# Altium schematic sheet 03-Main.SchDoc
size D
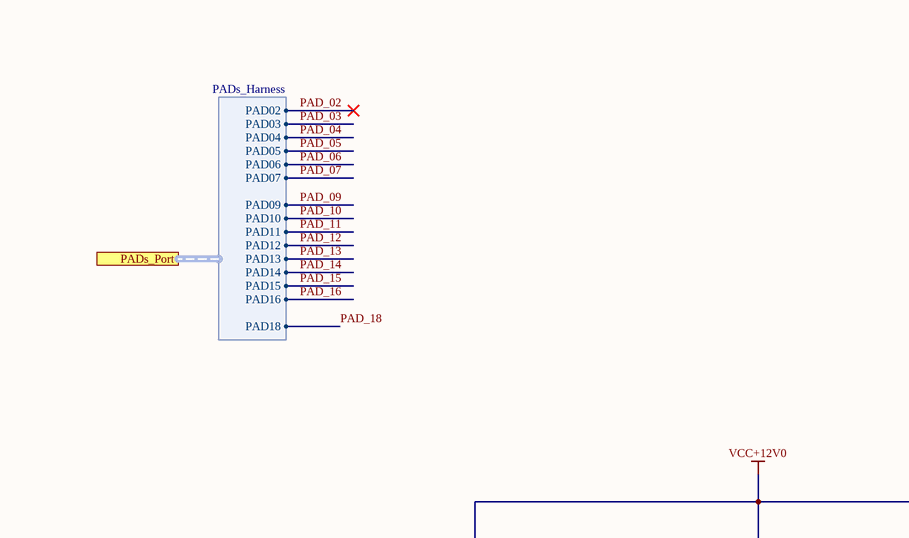
[diagram p0: 03-Main.SchDoc, top left]
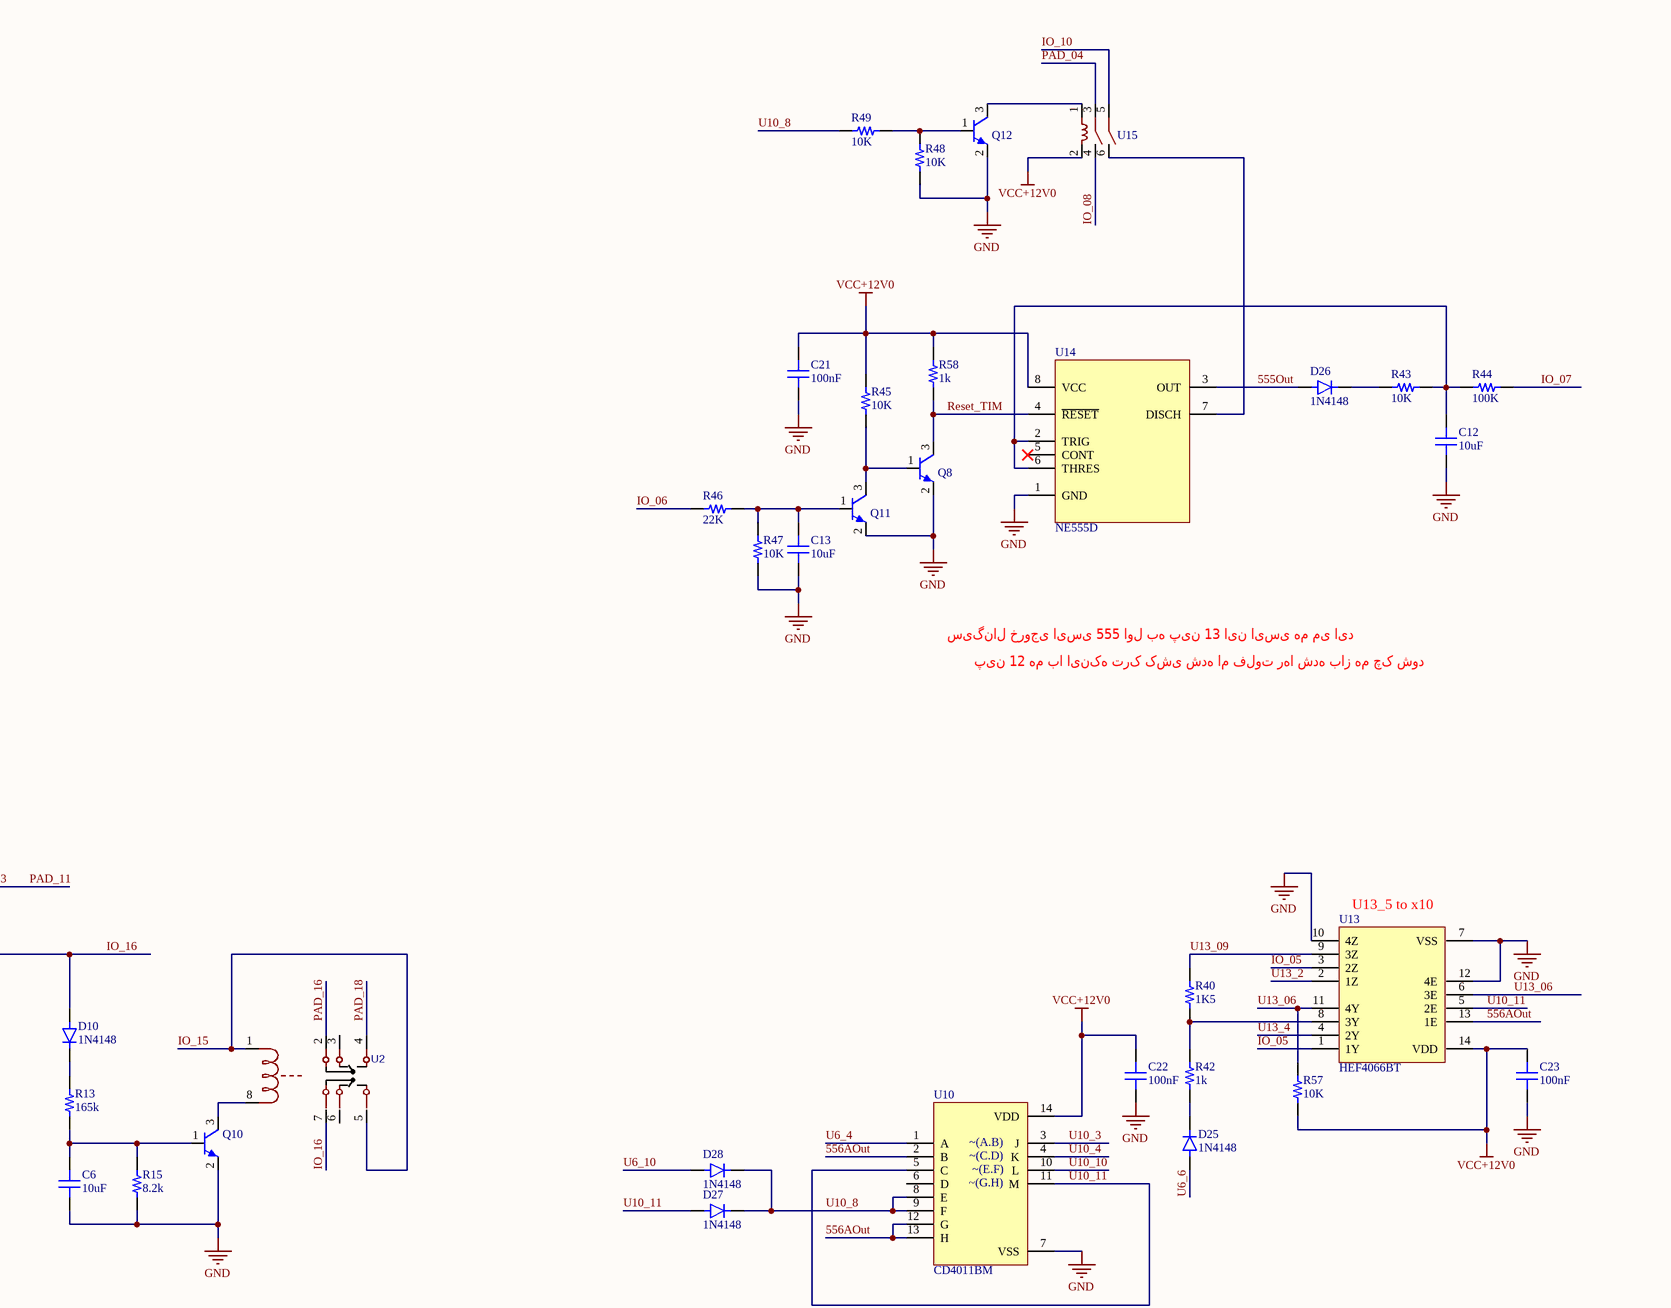
[diagram p1: 03-Main.SchDoc, top right]
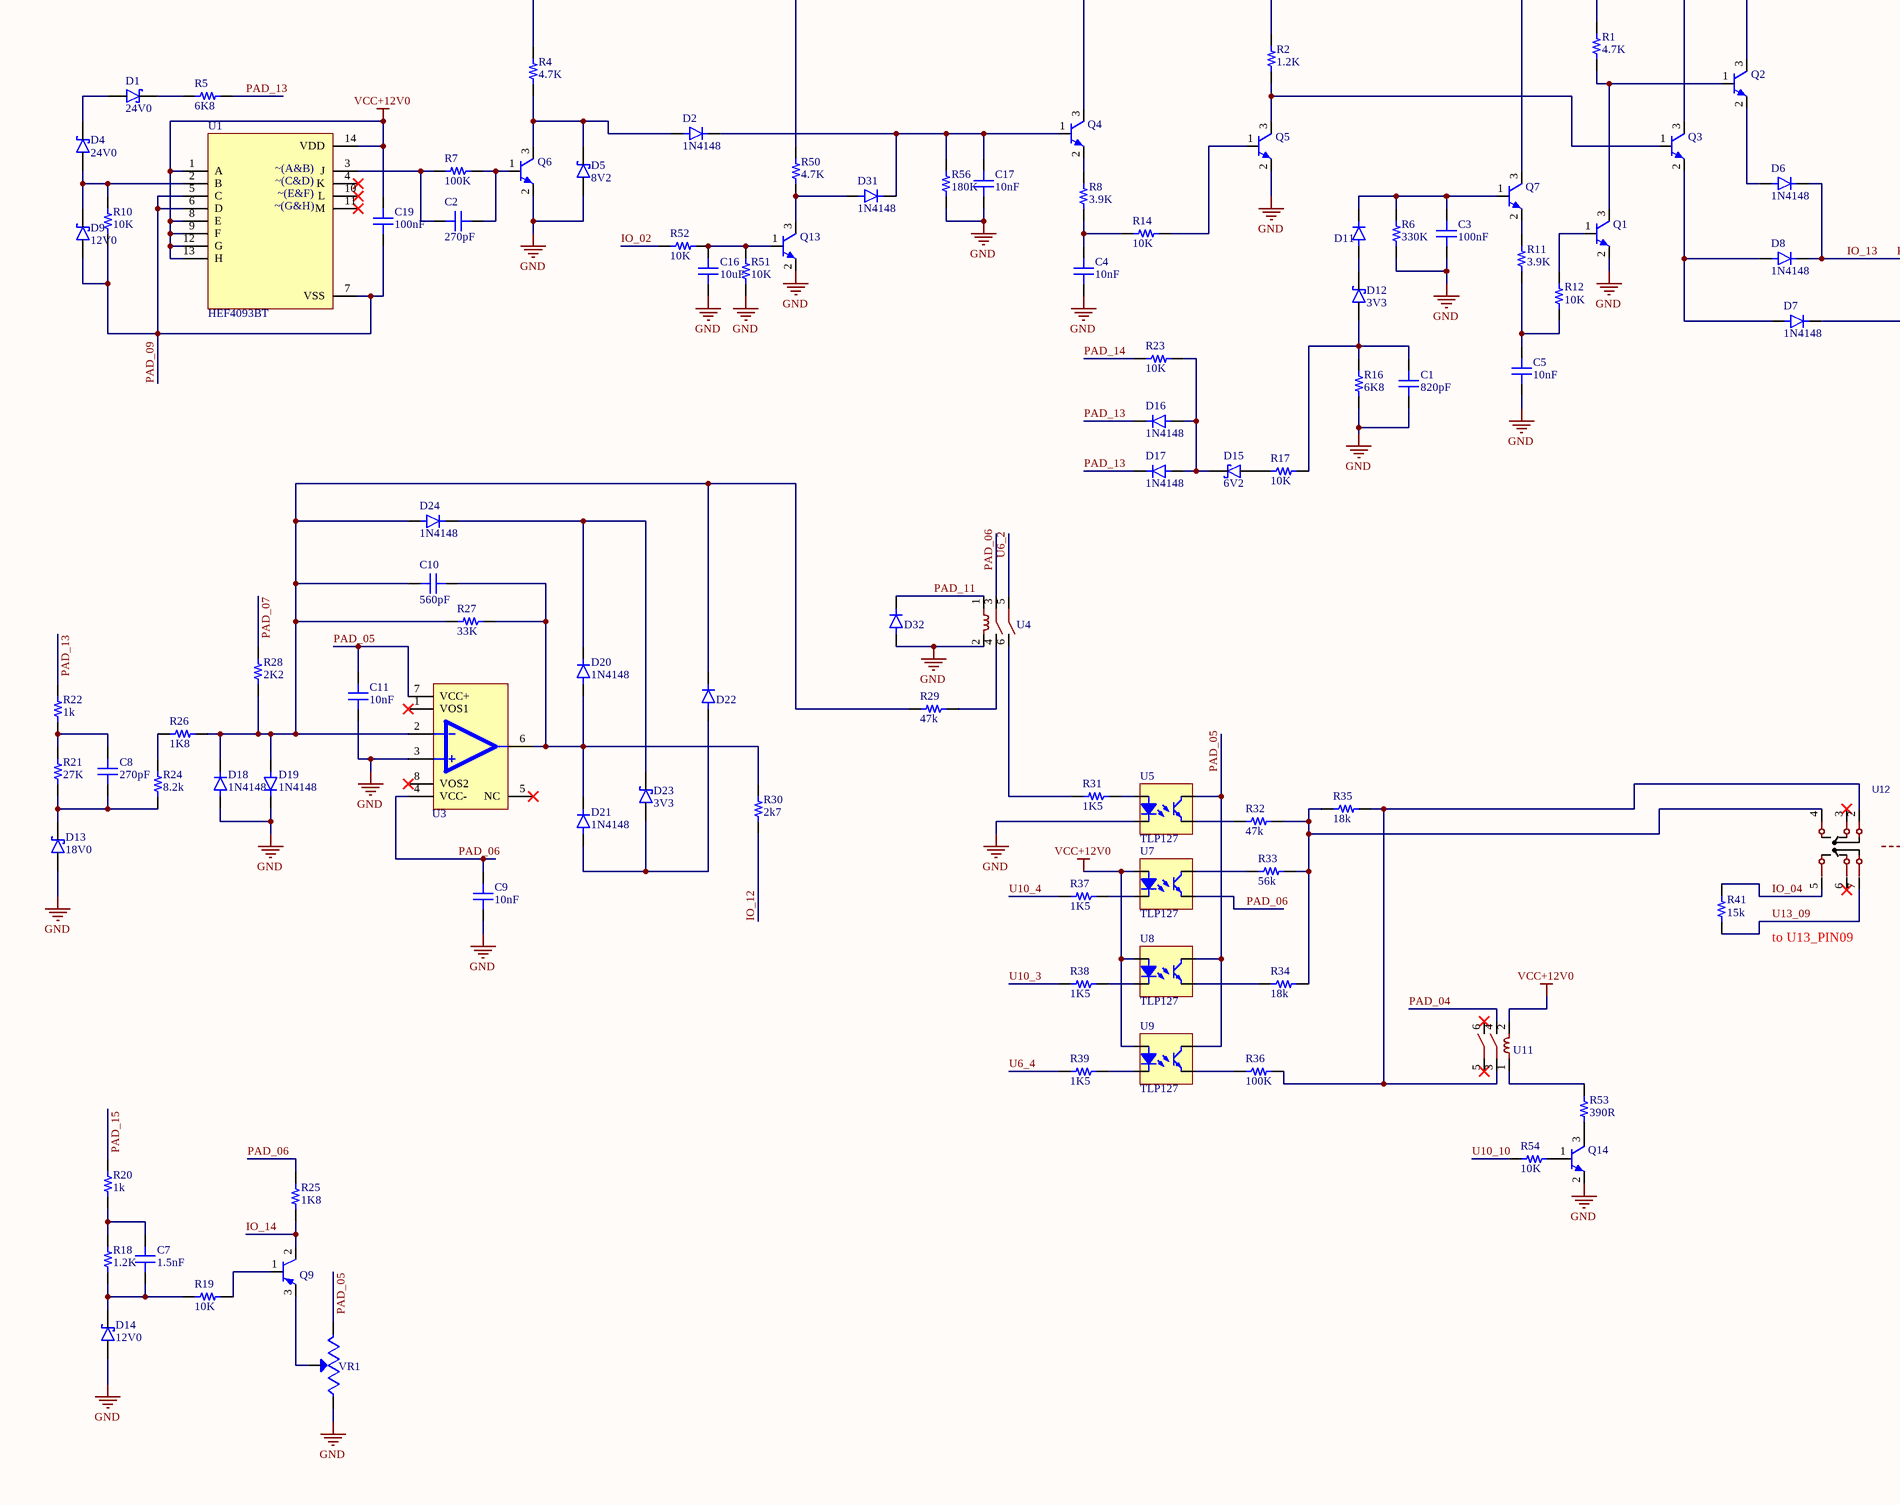
[diagram p2: 03-Main.SchDoc, bottom left]
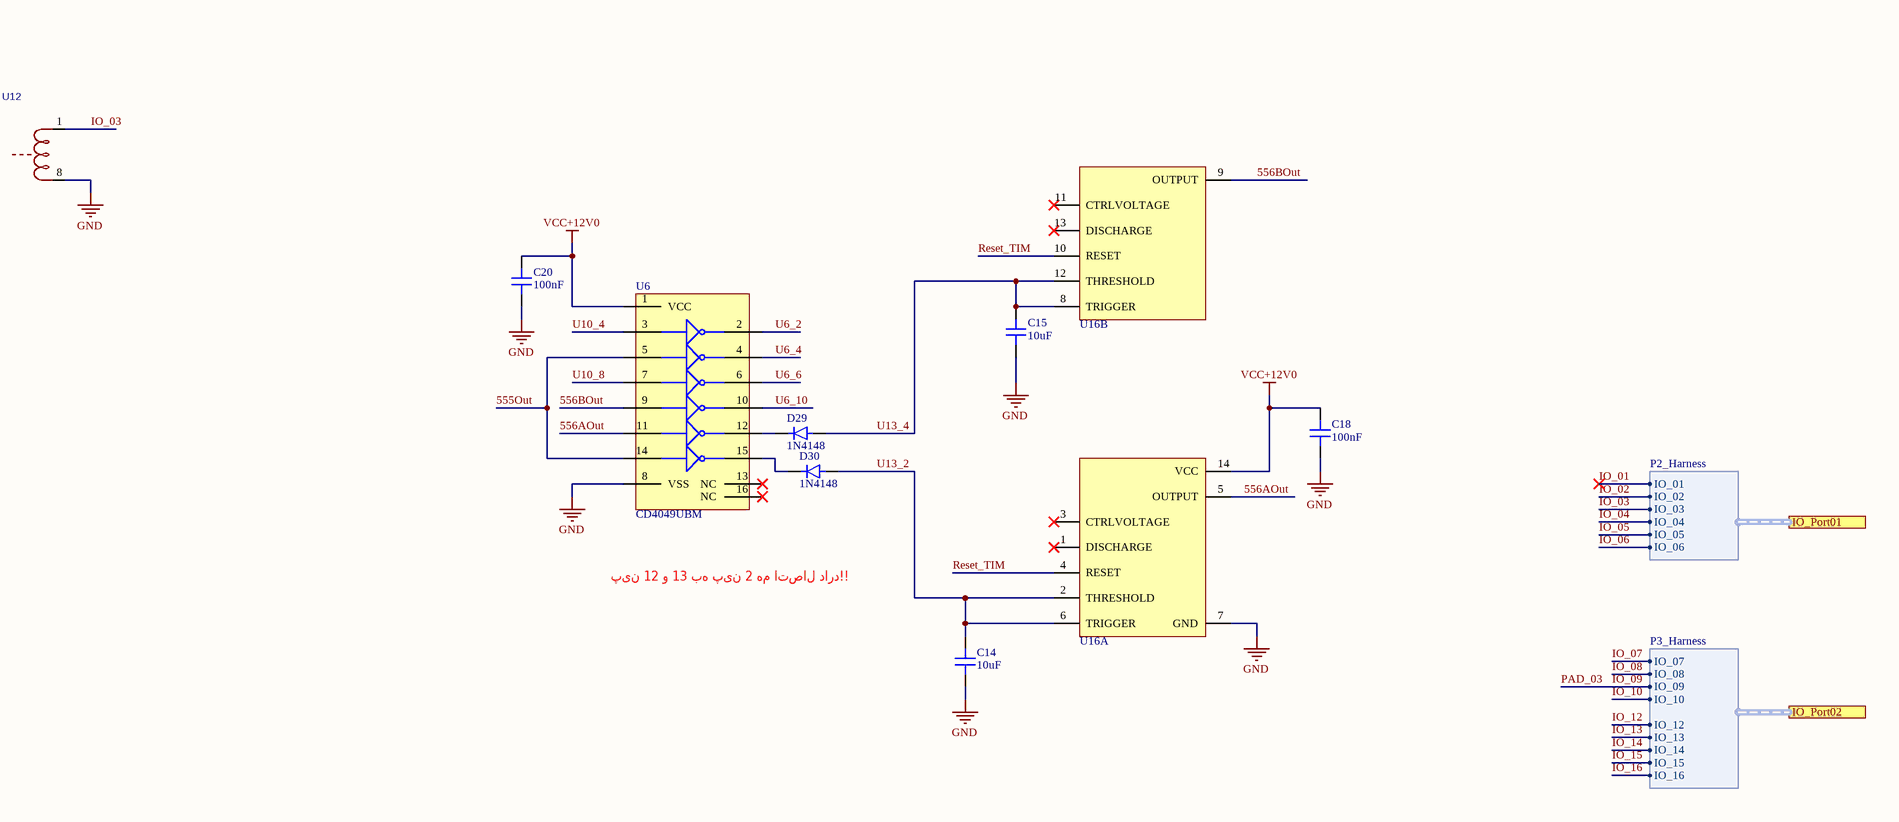
[diagram p3: 03-Main.SchDoc, bottom right]

## Parts
C1  820pF  [Cap0805]
C2  270pF  [Cap0805]
C3  100nF  [Cap0805]
C4  10nF  [Cap0805]
C5  10nF  [Cap0805]
C6  10uF  [Cap0603]
C7  1.5nF  [Cap0805]
C8  270pF  [Cap0805]
C9  10nF  [Cap0805]
C10  560pF  [Cap0603]
C11  10nF  [Cap0805]
C12  10uF  [Cap1206]
C13  10uF  [Cap0805]
C14  10uF  [Cap1206]
C15  10uF  [Cap1206]
C16  10uF  [Cap1206]
C17  10nF  [Cap0805]
C18  100nF  [Cap0805]
C19  100nF  [Cap0805]
C20  100nF  [Cap0805]
C21  100nF  [Cap0805]
C22  100nF  [Cap0805]
C23  100nF  [Cap0805]
D1  24V0  [Melf]
D2  1N4148  [SOD-123]
D4  24V0  [Melf]
D5  8V2  [Melf]
D6  1N4148  [SOD-123]
D7  1N4148  [SOD-123]
D8  1N4148  [SOD-123]
D9  12V0  [Melf]
D10  1N4148  [SOD-123]
D11  1N4148  [SOD-123]  (value not drawn)
D12  3V3  [Melf]
D13  18V0  [Melf]
D14  12V0  [Melf]
D15  6V2  [Melf]
D16  1N4148  [SOD-123]
D17  1N4148  [SOD-123]
D18  1N4148  [SOD-123]
D19  1N4148  [SOD-123]
D20  1N4148  [SOD-123]
D21  1N4148  [SOD-123]
D22  1N4148  [SOD-123]  (value not drawn)
D23  3V3  [MINIMELF]
D24  1N4148  [SOD-123]
D25  1N4148  [SOD-123]
D26  1N4148  [SOD-123]
D27  1N4148  [SOD-123]
D28  1N4148  [SOD-123]
D29  1N4148  [SOD-123]
D30  1N4148  [SOD-123]
D31  1N4148  [SOD-123]
D32  1N4148  [SOD-123]  (value not drawn)
Q1  BC337-DIP  [SOT54]  (value not drawn)
Q2  BC337-DIP  [SOT54]  (value not drawn)
Q3  BC337-DIP  [SOT54]  (value not drawn)
Q4  BC337-DIP  [SOT54]  (value not drawn)
Q5  BC337-DIP  [SOT54]  (value not drawn)
Q6  BC337-DIP  [SOT54]  (value not drawn)
Q7  BC337-DIP  [SOT54]  (value not drawn)
Q8  BC337-DIP  [SOT54]  (value not drawn)
Q9  BC177  [TO-18]  (value not drawn)
Q10  BC337-DIP  [SOT54]  (value not drawn)
Q11  BC337-DIP  [SOT54]  (value not drawn)
Q12  BC337-DIP  [SOT54]  (value not drawn)
Q13  BC337-DIP  [SOT54]  (value not drawn)
Q14  BC337-DIP  [SOT54]  (value not drawn)
R1  4.7K  [Res1206]
R2  1.2K  [Res1206]
R4  4.7K  [Res1206]
R5  6K8  [Res1206]
R6  330K  [Res1206]
R7  100K  [Res1206]
R8  3.9K  [Res1206]
R10  10K  [Res1206]
R11  3.9K  [Res1206]
R12  10K  [Res1206]
R13  165k  [Res1206]
R14  10K  [Res1206]
R15  8.2k  [Res1206]
R16  6K8  [Res1206]
R17  10K  [Res1206]
R18  1.2K  [Res1206]
R19  10K  [Res1206]
R20  1k  [Res1206]
R21  27K  [Res1206]
R22  1k  [Res1206]
R23  10K  [Res1206]
R24  8.2k  [Res1206]
R25  1K8  [Res1206]
R26  1K8  [Res1206]
R27  33K  [Res1206]
R28  2K2  [Res1206]
R29  47k  [Res1206]
R30  2k7  [Res1206]
R31  1K5  [Res1206]
R32  47k  [Res1206]
R33  56k  [Res1206]
R34  18k  [Res1206]
R35  18k  [Res1206]
R36  100K  [Res1206]
R37  1K5  [Res1206]
R38  1K5  [Res1206]
R39  1K5  [Res1206]
R40  1K5  [Res1206]
R41  15k  [Res1206]
R42  1k  [Res1206]
R43  10K  [Res1206]
R44  100K  [Res1206]
R45  10K  [Res1206]
R46  22K  [Res1206]
R47  10K  [Res1206]
R48  10K  [Res1206]
R49  10K  [Res1206]
R50  4.7K  [Res1206]
R51  10K  [Res1206]
R52  10K  [Res1206]
R53  390R  [Res1206]
R54  10K  [Res1206]
R56  180K  [Res1206]
R57  10K  [Res1206]
R58  1k  [Res1206]
U1  HEF4093BT  [SOIC-14]
U2  HRS2H-S-DC24V  [HRS2H-S-DC24V]  (value not drawn)
U3  OP07CD  [SOP8]  (value not drawn)
U4  OL-C-212H  [ol-c-212H]  (value not drawn)
U5  TLP127  [TLP127]
U6  CD4049UBM  [SOIC-16]
U7  TLP127  [TLP127]
U8  TLP127  [TLP127]
U9  TLP127  [TLP127]
U10  CD4011BM  [SOIC-14]
U11  OL-C-212H  [ol-c-212H]  (value not drawn)
U12  HRS2H-S-DC24V  [HRS2H-S-DC24V]  (value not drawn)
U13  HEF4066BT  [SOIC-14]
U14  NE555D  [SOP8]
U15  OL-C-212H  [ol-c-212H]  (value not drawn)
U16  NE556D  [SOIC-14]  (value not drawn)  (parts A,B of 2)
VR1  10k  [Multi_Turn]  (value not drawn)

## Ports
IO_Port01 (harness P2_Harness), IO_Port02 (harness P3_Harness), PADs_Port (harness PADs_Harness)

## Harnesses
PADs_Harness: PAD02, PAD03, PAD04, PAD05, PAD06, PAD07, PAD09, PAD10, PAD11, PAD12, PAD13, PAD14, PAD15, PAD16, PAD18
P2_Harness: IO_01, IO_02, IO_03, IO_04, IO_05, IO_06
P3_Harness: IO_07, IO_08, IO_09, IO_10, IO_12, IO_13, IO_14, IO_15, IO_16

## Nets
GND: C1.1 C3.2 C4.1 C5.1 C6.1 C9.1 C11.1 C12.1 C13.1 C14.1 C15.1 C16.2 C17.2 C18.2 C20.1 C21.2 C22.1 C23.2 D5.A D13.A D14.A D18.A D19.C D32.A Q1.2(E) Q5.2(E) Q6.2(E) Q8.2(E) Q10.2(E) Q11.2(E) Q12.2(E) Q13.2(E) Q14.2(E) R6.1 R15.1 R16.1 R47.1 R48.1 R51.1 R56.2 U3.3(IN+) U4.2 U5.2 U6.8(VSS) U10.7(VSS) U12.8 U13.7(VSS) U13.10(4Z) U13.12(4E) U14.1(GND) U16.7(GND) VR1.1(CCW)
VCC+12V0: C18.1 C19.2 C20.2 C21.1 C22.2 C23.1 Q2.3(C) Q3.3(C) Q4.3(C) Q7.3(C) R1.1 R2.2 R4.2 R45.2 R50.2 R57.1 R58.2 U1.1(A) U1.8(E) U1.9(F) U1.12(G) U1.13(H) U1.14(VDD) U6.1(VCC) U7.1 U8.1 U9.1 U10.14(VDD) U11.2 U13.14(VDD) U14.8(VCC) U15.2 U16.14(VCC)
555Out: D26.A U6.5(B) U6.14(F) U14.3(OUT)
556AOut: U6.11(E) U10.2(B) U10.12(G) U10.13(H) U13.13(1E) U16.5(OUTPUT)
556BOut: U6.9(D) U16.9(OUTPUT)
IO_01: port IO_Port01.IO_01
IO_02: R52.2 ; port IO_Port01.IO_02
IO_03: U12.1 ; port IO_Port01.IO_03
IO_04: R41.2 U12.5 ; port IO_Port01.IO_04
IO_05: U13.1(1Y) U13.3(2Z) ; port IO_Port01.IO_05
IO_06: R46.1 ; port IO_Port01.IO_06
IO_07: R44.1 ; port IO_Port02.IO_07
IO_08: U15.4 ; port IO_Port02.IO_08
IO_09: port PADs_Port.PAD03, port IO_Port02.IO_09  [also labelled PAD_03]
IO_10: U15.5 ; port IO_Port02.IO_10
IO_12: R30.1 ; port IO_Port02.IO_12
IO_13: D6.C D8.C D32.C U4.1 ; port PADs_Port.PAD11, port IO_Port02.IO_13  [also labelled PAD_11]
IO_14: Q9.2(C) R25.2 ; port IO_Port02.IO_14
IO_15: U2.1 U2.5 ; port IO_Port02.IO_15
IO_16: D7.C D10.A U2.7 ; port IO_Port02.IO_16
PAD_02: port PADs_Port.PAD02
PAD_04: U11.4 U15.3 ; port PADs_Port.PAD04
PAD_05: C11.2 U3.7(VCC+) U5.4 U8.4 U9.4 VR1.3(CW) ; port PADs_Port.PAD05
PAD_06: C9.2 R25.1 U3.4(VCC-) U4.3 U7.3 ; port PADs_Port.PAD06
PAD_07: R28.1 ; port PADs_Port.PAD07
PAD_09: C19.1 D9.A R10.1 U1.5(C) U1.6(D) U1.7(VSS) ; port PADs_Port.PAD09
PAD_10: port PADs_Port.PAD10
PAD_12: port PADs_Port.PAD12
PAD_13: D16.C D17.C R5.2 R22.1 ; port PADs_Port.PAD13
PAD_14: R23.1 ; port PADs_Port.PAD14
PAD_15: R20.1 ; port PADs_Port.PAD15
PAD_16: U2.2 ; port PADs_Port.PAD16
PAD_18: U2.4 ; port PADs_Port.PAD18
Reset_TIM: Q8.3(C) R58.1 U14.4(~{RESET}) U16.4(RESET) U16.10(RESET)
U6_2: U4.5 U6.2(G)
U6_4: R39.1 U6.4(H) U10.1(A)
U6_6: D25.A U6.6(I)
U6_10: D28.A U6.10(J)
U10_3: R38.1 U10.3(J)
U10_4: R37.1 U6.3(A) U10.4(K)
U10_8: D27.C D28.C R49.2 U6.7(C) U10.8(E) U10.9(F)
U10_10: R54.2 U10.10(L)
U10_11: D27.A U10.5(C) U10.11(M) U13.5(2E)
U13_2: C14.2 D30.A U13.2(1Z) U16.2(THRESHOLD) U16.6(TRIGGER)
U13_4: C15.2 D29.A U13.4(2Y) U16.8(TRIGGER) U16.12(THRESHOLD)
U13_06: R57.2 U13.6(3E) U13.11(4Y)
U13_09: R40.1 R41.1 U12.7 U13.9(3Z)
NetC1_2: C1.2 D12.A R16.2 R17.2
NetC2_1: C2.1 R7.1 U1.3(J)
NetC2_2: C2.2 Q6.1(B) R7.2
NetC3_1: C3.1 D11.C Q7.1(B) R6.2
NetC4_2: C4.2 R8.2 R14.2
NetC5_2: C5.2 R11.1 R12.1
NetC6_2: C6.2 Q10.1(B) R13.1 R15.2
NetC7_1: C7.1 D14.C R18.1 R19.1
NetC7_2: C7.2 R18.2 R20.2
NetC8_1: C8.1 D13.C R21.2 R24.2
NetC8_2: C8.2 R21.1 R22.2
NetC10_1: C10.1 D20.A D21.C R27.1 R30.2 U3.6(OUT)
NetC10_2: C10.2 D18.C D19.A D22.C D24.A R26.1 R27.2 R28.2 R29.1 U3.2(IN-)
NetC12_2: C12.2 R43.2 R44.2 U14.2(TRIG) U14.6(THRES)
NetC13_2: C13.2 Q11.1(B) R46.2 R47.2
NetC16_1: C16.1 Q13.1(B) R51.2 R52.1
NetC17_1: C17.1 D2.C D31.C Q4.1(B) R56.1
NetD1_A: D1.A D4.C
NetD1_C: D1.C R5.1
NetD2_A: D2.A D5.C Q6.3(C) R4.1
NetD4_A: D4.A D9.C R10.2 U1.2(B)
NetD6_A: D6.A Q2.2(E)
NetD7_A: D7.A D8.A Q3.2(E)
NetD10_C: D10.C R13.2
NetD11_A: D11.A D12.C
NetD15_A: D15.A R17.1
NetD15_C: D15.C D16.A D17.A R23.2
NetD20_C: D20.C D23.C D24.C
NetD21_A: D21.A D22.A D23.A
NetD25_C: D25.C R42.2
NetD26_C: D26.C R43.1
NetD29_C: D29.C U6.12(K)
NetD30_C: D30.C U6.15(L)
NetD31_A: D31.A Q13.3(C) R50.1
NetQ1_1: Q1.1(B) R12.2
NetQ1_3: Q1.3(C) Q2.1(B) R1.2
NetQ3_1: Q3.1(B) Q5.3(C) R2.1
NetQ4_2: Q4.2(E) R8.1
NetQ5_1: Q5.1(B) R14.1
NetQ7_2: Q7.2(E) R11.2
NetQ8_1: Q8.1(B) Q11.3(C) R45.1
NetQ9_1: Q9.1(B) R19.2
NetQ9_3: Q9.3(E) VR1.2(WIPER)
NetQ10_3: Q10.3(C) U2.8
NetQ12_1: Q12.1(B) R48.2 R49.1
NetQ12_3: Q12.3(C) U15.1
NetQ14_1: Q14.1(B) R54.1
NetQ14_3: Q14.3(C) R53.1
NetR24_1: R24.1 R26.2
NetR29_2: R29.2 U4.4
NetR31_1: R31.1 U4.6
NetR31_2: R31.2 U5.1
NetR32_1: R32.1 R33.1 R34.1 R35.1 U12.4
NetR32_2: R32.2 U5.3
NetR33_2: R33.2 U7.4
NetR34_2: R34.2 U8.3
NetR35_2: R35.2 R36.2 U11.3 U12.2
NetR36_1: R36.1 U9.3
NetR37_2: R37.2 U7.2
NetR38_2: R38.2 U8.2
NetR39_2: R39.2 U9.2
NetR40_2: R40.2 R42.1 U13.8(3Y)
NetR53_2: R53.2 U11.1
NetU14_7: U14.7(DISCH) U15.6

Not connected (* = marked no-connect by the designer): U1 4(K)* 10(L)* 11(M)*; U2 3 6; U3 1(VOS1)* 5(NC)* 8(VOS2)*; U6 13(NC)* 16(NC)*; U10 6(D); U11 5* 6*; U12 3* 6*; U14 5(CONT)*; U16 1(DISCHARGE)* 3(CTRLVOLTAGE)* 11(CTRLVOLTAGE)* 13(DISCHARGE)*

## Notes on the sheet
- سیگنال خروجی ایسی 555 اول به پین 13 این ایسی هم می اید
- پین 12 هم با اینکه ترک کشی شده ام فلوت رها شده باز هم چک شود
- (near U13) U13_5 to x10
- to U13_PIN09
- پین 12 و 13 به پین 2 هم اتصال دارد!!
- (in symbol CD4011BM) ~(A.B); ~(C.D); ~(E.F); ~(G.H)
- (in symbol HEF4093BT) ~(A&B); ~(C&D); ~(E&F); ~(G&H)

## Library data of the parts
C1 = Cap-0805-820pF: Cap 0805 820pF; ID: 118; Additionner: A.Abdolahzadeh; Part Number: Cap-0805-820pF; Category: Cap; Sub-Category: Cer0805; Adding Time: 1402-10-20
C2 C8 = Cap-0805-270pF: Cap 0805 270pF; ID: 120; Additionner: A.Abdolahzadeh; Part Number: Cap-0805-270pF; Category: Cap; Sub-Category: Cer0805; Adding Time: 1402-10-20
C3 C18-C23 = Cap-0805-100nF: Cap 0805 100nF; Manufacturer: ---; ID: 51; Additionner: S.Pourmohammad; Part Number: Cap-0805-100nF; Category: Cap; Sub-Category: Cer0805; Adding Time: 1402-05-18; Datasheet Path: ---; Supplier: Ic Kala
C4 C5 C9 C11 C17 = Cap-0805-10nF: Cap 0805 10nF; ID: 122; Additionner: A.Abdolahzadeh; Part Number: Cap-0805-10nF; Category: Cap; Sub-Category: Cer0805; Adding Time: 1402-10-20
C6 = Cap-0603-10uF: Cap 0603 10uF; Manufacturer: ---; ID: 40; Additionner: A.Abdolahzadeh; Part Number: Cap-0603-10uF; Category: Cap; Sub-Category: Cer0603; Adding Time: 1401-05-17; Datasheet Path: ---
C7 = Cap-0805-1.5nF: Cap 0805 1.5nF; ID: 121; Additionner: A.Abdolahzadeh; Part Number: Cap-0805-1.5nF; Category: Cap; Sub-Category: Cer0805; Adding Time: 1402-10-20
C10 = Cap-0603-560pF: Cap 0603 560pF; ID: 123; Additionner: A.Abdolahzadeh; Part Number: Cap-0603-560pF; Category: Cap; Sub-Category: Cer0603; Adding Time: 1402-10-20
C12 C14-C16 = Cap-1206-10uF: Cap 1206 10uF 50V; Manufacturer: ---; ID: 48; Additionner: S.Pourmohammad; Part Number: Cap-1206-10uF; Category: Cap; Sub-Category: Cer1206; Adding Time: 1401-06-09; Datasheet Path: ---; Supplier: Ic Kala
C13 = Cap-0805-10uF: Cap 0805 10uF; Manufacturer: ---; ID: 49; Additionner: S.Pourmohammad; Part Number: Cap-0805-10uF; Category: Cap; Sub-Category: Cer0805; Adding Time: 1401-05-17; Datasheet Path: ---; Supplier: Ic Kala
D1 D5 D9 D15 = ZM: Zener Diode Melf; Part Number: ZM; MP: TMMBAT41; MF: STMicroelectronics; ID: 132; Additionner: S.Pourmohammad; SnapEDA_Link: https://www.snapeda.com/parts/TMMBAT41/STMicroelectronics/view-part/2894620/?ref=snap; Value: *; Availability: Not in stock; Check_prices: https://www.snapeda.com/parts/TMMBAT41/STMicroelectronics/view-part/2894620/?ref=eda; Package: DO-213 STMicroelectronics; Price: None; Category: Diode; Sub-Category: Zener
D2 D6-D8 D10 D11 D16-D22 D24-D32 = 1N4148: Diode Standard 75 V 300mA (DC) Through Hole DO-35 Mimi Melf; MF: ON Semiconductor; ID: 113; Additionner: S.Pourmohammad; Price: None; Value: *; Check_prices: https://www.snapeda.com/parts/1N4148/Onsemi/view-part/?ref=eda; Purchase-URL: https://pricing.snapeda.com/search/part/1N4148/?ref=eda; Package: AXIAL LEAD-2 ON Semiconductor; SnapEDA_Link: https://www.snapeda.com/parts/1N4148/Onsemi/view-part/?ref=snap; Availability: In Stock; MP: 1N4148; Part Number: 1N4148; Category: Diode; Sub-Category: standard; Adding Time: 1402-10-1
D4 D12-D14 = ZM: Zener Diode Melf; Part Number: ZM; MF: STMicroelectronics; MP: TMMBAT41; ID: 132; Additionner: S.Pourmohammad; Price: None; Value: *; Check_prices: https://www.snapeda.com/parts/TMMBAT41/STMicroelectronics/view-part/2894620/?ref=eda; Package: DO-213 STMicroelectronics; SnapEDA_Link: https://www.snapeda.com/parts/TMMBAT41/STMicroelectronics/view-part/2894620/?ref=snap; Availability: Not in stock; Category: Diode; Sub-Category: Zener
D23 = ZMM: Zener Diode MiniMelf; Part Number: ZMM; MF: STMicroelectronics; MP: TMMBAT41; ID: 131; Additionner: S.Pourmohammad; Price: None; Value: *; Check_prices: https://www.snapeda.com/parts/TMMBAT41/STMicroelectronics/view-part/2894620/?ref=eda; Package: DO-213 STMicroelectronics; SnapEDA_Link: https://www.snapeda.com/parts/TMMBAT41/STMicroelectronics/view-part/2894620/?ref=snap; Availability: Not in stock; Category: Diode; Sub-Category: Zener
Q1-Q8 Q10-Q14 = BC337-DIP: General Purpose Transistor 45V - 500 mA NPN; Manufacturer: NXP; ID: 119; Additionner: A.Abdolahzadeh; Part Number: BC337-DIP; Category: Transistor; Sub-Category: BJT-NPN; Adding Time: 1402-9-24; Datasheet Path: Datasheets\BC337_PhilipsSemiconductors.pdf
Q9 = BC177: Manufacturer: ---; ID: 133; Additionner: A.Abdolahzadeh; MP: BCX53-16,115; MF: Nexperia USA; Part Number: BC177; Category: Transistor; Sub-Category: BJT-PNP; Adding Time: 1402-09-26; Datasheet Path: ---; Package: SOT-89-3 Nexperia; Price: None; Availability: Unavailable; Value: *; SnapEDA_Link: https://www.snapeda.com/parts/BCX53-16,115/Nexperia%20USA%20Inc./view-part/1098173/?ref=snap
R1 R4 R50 = Res-1206-4.7k: Manufacturer: ---; Value: 1K; ID: 95; Additionner: A.Abdolahzadeh; Part Number: Res-1206-4.7k; Category: Res; Sub-Category: SMD-1206; Adding Time: 1402-09-24; Datasheet Path: ---
R2 R18 = Res-1206-1.2k: Manufacturer: ---; Value: 1K; ID: 92; Additionner: A.Abdolahzadeh; Part Number: Res-1206-1.2k; Category: Res; Sub-Category: SMD-1206; Adding Time: 1402-09-24; Datasheet Path: ---
R5 R16 = Res-1206-6K8: Resistor 1206 6.8 Kohm; Value: 1K; ID: 67; Additionner: S.Pourmohammad; Part Number: Res-1206-6K8; Category: Res; Sub-Category: SMD-1206; Adding Time: 1402-10-1; Supplier: Ic Kala
R6 = Res-1206-330K: Manufacturer: ---; Value: 1K; ID: 91; Additionner: A.Abdolahzadeh; Part Number: Res-1206-330K; Category: Res; Sub-Category: SMD-1206; Adding Time: 1402-09-24; Datasheet Path: ---
R7 R44 = Res-1206-100k: Manufacturer: ---; Value: 1K; ID: 96; Additionner: A.Abdolahzadeh; Part Number: Res-1206-100K; Category: Res; Sub-Category: SMD-1206; Adding Time: 1402-09-24; Datasheet Path: ---
R8 R11 = Res-1206-3.9k: Manufacturer: ---; Value: 1K; ID: 94; Additionner: A.Abdolahzadeh; Part Number: Res-1206-3.9k; Category: Res; Sub-Category: SMD-1206; Adding Time: 1402-09-24; Datasheet Path: ---
R10 R12 R14 R17 R19 R23 R43 R45 R47-R49 R51 R52 R54 R57 = Res-1206-10K: Resistor 1206 10 Kohm; Manufacturer: ---; Value: 1K; ID: 66; Additionner: S.Pourmohammad; Part Number: Res-1206-10K; Category: Res; Sub-Category: SMD-1206; Adding Time: 1402-10-1; Datasheet Path: ---; Supplier: Ic Kala
R13 = Res-1206-165K: Manufacturer: ---; Value: 1K; ID: 111; Additionner: A.Abdolahzadeh; Part Number: Res-1206-165K; Category: Res; Adding Time: 1402-09-26; Datasheet Path: ---
R15 R24 = Res-1206-8.2K: Manufacturer: ---; Value: 1K; ID: 112; Additionner: A.Abdolahzadeh; Part Number: Res-1206-8.2K; Category: Res; Adding Time: 1402-09-26; Datasheet Path: ---
R20 R22 R42 R58 = Res-1206-1K: Manufacturer: ---; ID: 88; Additionner: A.Abdolahzadeh; Value: 1K; Part Number: Res-1206-1K; Category: Res; Adding Time: 1402-09-26; Datasheet Path: ---
R21 = Res-1206-27K: Resistor 1206 27 Kohm; Value: 1K; ID: 70; Additionner: S.Pourmohammad; Part Number: Res-1206-27K; Category: Res; Sub-Category: SMD-1206; Adding Time: 1402-10-1; Supplier: Ic Kala
R25 R26 = Res-1206-1K8: Resistor 1206 1.8 Kohm; Value: 1K; ID: 102; Additionner: S.Pourmohammad; Part Number: Res-1206-1K8; Category: Res; Sub-Category: SMD-1206; Adding Time: 1402-10-1; Supplier: Ic Kala
R27 = Res-1206-33K: Resistor 1206 33 Kohm; Value: 1K; ID: 71; Additionner: S.Pourmohammad; Part Number: Res-1206-33K; Category: Res; Sub-Category: SMD-1206; Adding Time: 1402-10-1; Supplier: Ic Kala
R28 = Res-1206-2K2: Resistor 1206 2.2 Kohm; Value: 1K; ID: 82; Additionner: S.Pourmohammad; Part Number: Res-1206-2K2; Category: Res; Sub-Category: SMD-1206; Adding Time: 1402-10-1; Supplier: Ic Kala
R29 R32 = Res-1206-47K: Manufacturer: ---; Value: 1K; ID: 109; Additionner: A.Abdolahzadeh; Part Number: Res-1206-47K; Category: Res; Adding Time: 1402-09-26; Datasheet Path: ---
R30 = Res-1206-2K7: Manufacturer: ---; Value: 1K; ID: 110; Additionner: A.Abdolahzadeh; Part Number: Res-1206-2K7; Category: Res; Adding Time: 1402-09-26; Datasheet Path: ---
R31 R37-R40 = Res-1206-1K5: Resistor 1206 1.5 Kohm; Value: 1K; ID: 99; Additionner: S.Pourmohammad; Part Number: Res-1206-1K5; Category: Res; Sub-Category: SMD-1206; Adding Time: 1402-10-1; Supplier: Ic Kala
R33 = Res-1206-56K: Manufacturer: ---; Value: 1K; ID: 107; Additionner: A.Abdolahzadeh; Part Number: Res-1206-56K; Category: Res; Adding Time: 1402-09-26; Datasheet Path: ---
R34 R35 = Res-1206-18K: Manufacturer: ---; Value: 1K; ID: 108; Additionner: A.Abdolahzadeh; Part Number: Res-1206-18K; Category: Res; Adding Time: 1402-09-26; Datasheet Path: ---
R36 = Res-1206-100K: Manufacturer: ---; Value: 1K; ID: 96; Additionner: A.Abdolahzadeh; Part Number: Res-1206-100K; Category: Res; Sub-Category: SMD-1206; Adding Time: 1402-09-24; Datasheet Path: ---
R41 = Res-1206-15k: Manufacturer: ---; Value: 1K; ID: 98; Additionner: A.Abdolahzadeh; Part Number: Res-1206-15k; Category: Res; Sub-Category: SMD-1206; Adding Time: 1402-09-24; Datasheet Path: ---
R46 = Res-1206-22K: Resistor 1206 22 Kohm; Value: 1K; ID: 69; Additionner: S.Pourmohammad; Part Number: Res-1206-22K; Category: Res; Sub-Category: SMD-1206; Adding Time: 1402-10-1; Supplier: Ic Kala
R53 = Res-1206-390R: Manufacturer: ---; Value: 1K; ID: 106; Additionner: A.Abdolahzadeh; Part Number: Res-1206-390R; Category: Res; Adding Time: 1402-09-26; Datasheet Path: ---
R56 = Res-1206-180K: Resistor 1206 180K; Value: 1K; ID: 116; Additionner: A.Abdolahzadeh; Part Number: Res-1206-180K; Category: Res; Adding Time: 1402-10-13
U1 = HEF4093BT: 2 input NAND schmitt trigger with 4 channel; ID: 136; Additionner: A.Abdolahzadeh; Part Number: HEF4093BT; Category: Logic-IC; Sub-Category: NAND; Adding Time: 1402-10-12
U2 U12 = HRS2H-S-DC24V: Relay with 2 contact and 24VDC with 1A current; Manufacturer: HUIGANG; ID: 121; Additionner: S.Pourmohammad; Supplier: LCSC; Manufacturer Part: HRS2H-S-DC24V; Supplier Part: C12249; JLCPCB Part Class: Extended Part; spicePre: K; spiceSymbolName: HRS2H-S-DC24V; Part Number: HRS2H-S-DC24V; Category: Relay; Sub-Category: 2Contact; Adding Time: 1402-9-24; Datasheet Path: Datasheets\HRS2H-S-DC24v-h.pdf
U3 = OP07CD: Low-Offset voltage (0.25mV) single operational amplifier 8-SOIC 0 to 70; Manufacturer: Analog Device; MF: Texas Instruments; ID: 105; Additionner: A.Abdolahzadeh; Purchase-URL: https://pricing.snapeda.com/search/part/OP07CD/?ref=eda; Package: SOIC-8 Texas Instruments; SnapEDA_Link: https://www.snapeda.com/parts/OP07CD/Texas%20Instruments/view-part/516771/?ref=snap; Value: *; Price: None; MP: OP07CD; Availability: Unavailable; Part Number: OP07CD; Category: OpAmp; Sub-Category: 1 channel; Adding Time: 1402-09-26; Datasheet Path: Datasheets\OP07.pdf
U4 U11 U15 = OL-C-212H: REED RELAY  2 Contact; ID: 130; Additionner: S.Pourmohammad; Part Number: OL-C-212H; Category: Relay; Sub-Category: RELAY REED SPDT; Adding Time: 1402-10-1; Supplier: ……..
U5 U7-U9 = TLP127smd: typical Optocoupler with 1 channel and DIP; ID: 137; Additionner: A.Abdolahzadeh; Part Number: TLP127smd; Category: Optocoupler; Sub-Category: SMD; Adding Time: 1402-10-12
U6 = CD4049UBM: 6-ch, 3-V to 18-V inverters; Manufacturer: Texas Instrument; ID: 135; Additionner: A.Abdolahzadeh; Part Number: CD4049UBM; Category: Logic-IC; Sub-Category: NOT; Adding Time: 1402-10-12
U10 = CD4011BM: Manufacturer: Texas Instrument; ID: 134; Additionner: A.Abdolahzadeh; Package: None; MP: CD4011BE; Value: *; Availability: Unavailable; Price: None; Part Number: CD4011BM; Category: Logic-IC; Sub-Category: NAND; Adding Time: 1402-10-12
U13 = HEF4066BT: 4 Channel Circuit Analog IC Switch 1:1 with Enable; Manufacturer: Nexperia; MF: NXP Semiconductors; ID: 129; Additionner: A.Abdolahzadeh; Availability: Unavailable; Package: SO-14 NXP Semiconductors; MP: HEF4066BT; Value: *; Price: None; SnapEDA_Link: https://www.snapeda.com/parts/HEF4066BT/NXP%20Semiconductors/view-part/4303716/?ref=snap; Part Number: HEF4066BT; Category: Switch; Sub-Category: IC; Adding Time: 1402-09-27; Datasheet Path: Datasheets\HEF4066B-2938016.pdf
U14 = NE555D: 555 Type, Timer/Oscillator (Single) IC 500kHz 8-SOIC; Manufacturer: ST; MF: STMicroelectronics; ID: 104; Additionner: A.Abdolahzadeh; Availability: In Stock; SnapEDA_Link: https://www.snapeda.com/parts/NE555D/STMicroelectronics/view-part/?ref=snap; Price: None; Check_prices: https://www.snapeda.com/parts/NE555D/STMicroelectronics/view-part/?ref=eda; Package: SOIC-8 Texas Instruments; MP: NE555D; Value: *; Purchase-URL: https://pricing.snapeda.com/search/part/NE555D/?ref=eda; Part Number: NE555D; Category: Logic-IC; Sub-Category: Timer; Adding Time: 1402-09-26; Datasheet Path: Datasheets\NE555.pdf
U16 = NE556D: Dual 555 Timer 500kHz; Manufacturer: ST; MF: STMicroelectronics; ID: 128; Additionner: A.Abdolahzadeh; Value: *; Availability: Unavailable; Package: SOIC-14 Texas Instruments; Price: None; SnapEDA_Link: https://www.snapeda.com/parts/NE556D/STMicroelectronics/view-part/12906/?ref=snap; MP: NE556D; Part Number: NE556D; Category: Logic-IC; Sub-Category: Timer; Adding Time: 1402-09-27; Datasheet Path: Datasheets\NE556D.pdf
VR1 = Res Variable: Resistor Variable Multi turn; ID: 113; Additionner: S.Pourmohammad; MP: 3296W-OT1-204; MF: Bourns; Value: *; Part Number: Res Variable; Category: Res; Adding Time: 1402-09-26; SnapEDA_Link: https://www.snapeda.com/parts/3296W-OT1-204/Bourns/view-part/?ref=snap; Package: SOT-23-5 Bourns; Check_prices: https://www.snapeda.com/parts/3296W-OT1-204/Bourns/view-part/?ref=eda; Price: None; Availability: Not in stock